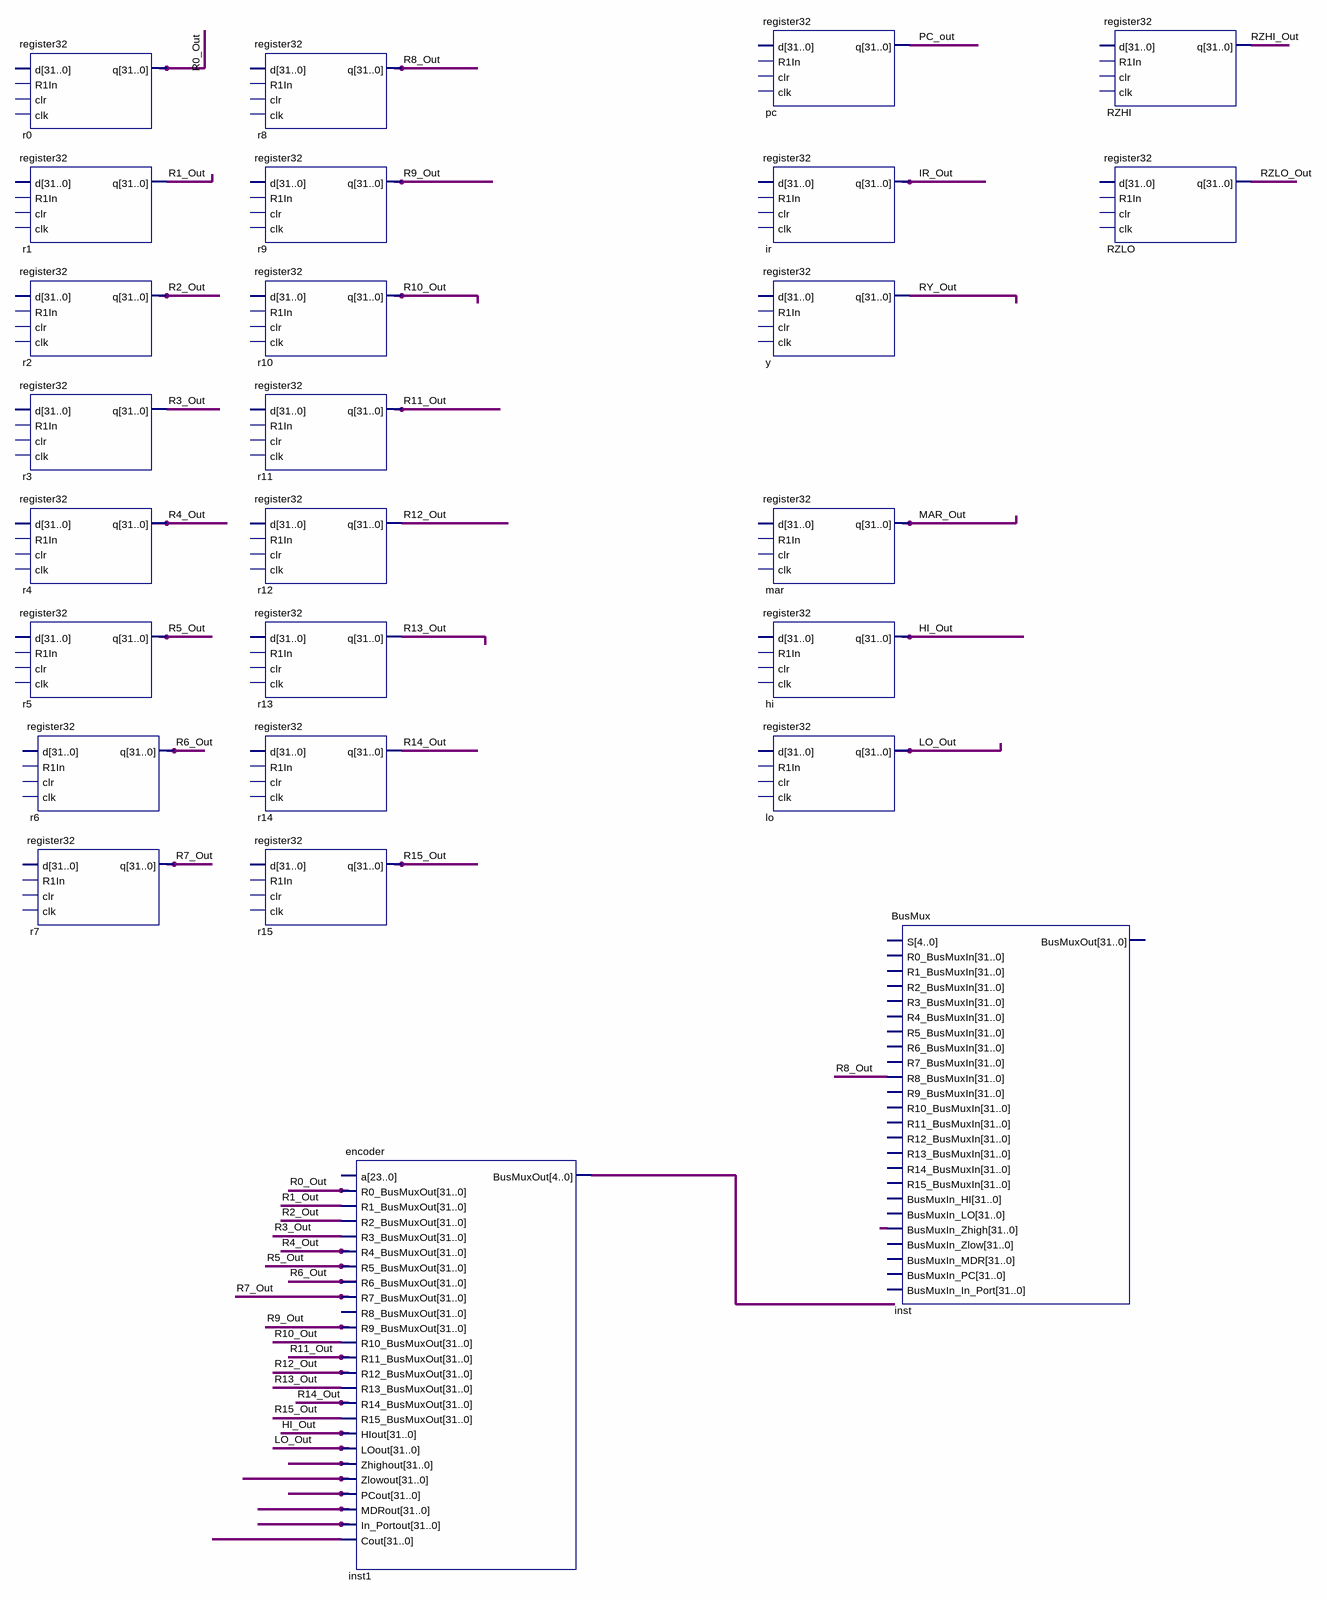
[diagram p0: schematic sheet]
// Quartus schematic Phase1Schematic.bdf as structural Verilog: 26 symbols, 0 pins
module Phase1Schematic (
);

  wire HI_Out, IR_Out, LO_Out, MAR_Out, PC_out, R0_Out, R1_Out, R2_Out, R3_Out, R4_Out, R5_Out, R6_Out,
       R7_Out, R8_Out, R9_Out, R10_Out, R11_Out, R12_Out, R13_Out, R14_Out, R15_Out, RY_Out, RZHI_Out,
       RZLO_Out;
  wire [4:0] inst1_busmuxout;
  wire [31:0] undriven, undriven_2, undriven_3, undriven_4, undriven_5, undriven_6, undriven_7;

  register32 r0 (.q(R0_Out));  // open: d, R1In, clr, clk
  register32 r1 (.q(R1_Out));  // open: d, R1In, clr, clk
  register32 r2 (.q(R2_Out));  // open: d, R1In, clr, clk
  register32 r3 (.q(R3_Out));  // open: d, R1In, clr, clk
  register32 r4 (.q(R4_Out));  // open: d, R1In, clr, clk
  register32 r5 (.q(R5_Out));  // open: d, R1In, clr, clk
  register32 r6 (.q(R6_Out));  // open: d, R1In, clr, clk
  register32 r7 (.q(R7_Out));  // open: d, R1In, clr, clk
  register32 r8 (.q(R8_Out));  // open: d, R1In, clr, clk
  register32 r9 (.q(R9_Out));  // open: d, R1In, clr, clk
  register32 r10 (.q(R10_Out));  // open: d, R1In, clr, clk
  register32 r11 (.q(R11_Out));  // open: d, R1In, clr, clk
  register32 r12 (.q(R12_Out));  // open: d, R1In, clr, clk
  register32 r13 (.q(R13_Out));  // open: d, R1In, clr, clk
  register32 r14 (.q(R14_Out));  // open: d, R1In, clr, clk
  register32 r15 (.q(R15_Out));  // open: d, R1In, clr, clk
  encoder inst1 (
    .R0_BusMuxOut({32{R0_Out}}), .R1_BusMuxOut({32{R1_Out}}), .R2_BusMuxOut({32{R2_Out}}),
    .R3_BusMuxOut({32{R3_Out}}), .R4_BusMuxOut({32{R4_Out}}), .R5_BusMuxOut({32{R5_Out}}),
    .R6_BusMuxOut({32{R6_Out}}), .R7_BusMuxOut({32{R7_Out}}), .R9_BusMuxOut({32{R9_Out}}),
    .R10_BusMuxOut({32{R10_Out}}), .R11_BusMuxOut({32{R11_Out}}), .R12_BusMuxOut({32{R12_Out}}),
    .R13_BusMuxOut({32{R13_Out}}), .R14_BusMuxOut({32{R14_Out}}), .R15_BusMuxOut({32{R15_Out}}),
    .HIout({32{HI_Out}}), .LOout({32{LO_Out}}), .Zhighout(undriven_3), .Zlowout(undriven_4),
    .PCout(undriven_5), .MDRout(undriven_6), .In_Portout(undriven_7), .Cout(undriven_2),
    .BusMuxOut(inst1_busmuxout));  // open: a, R8_BusMuxOut
  register32 pc (.q(PC_out));  // open: d, R1In, clr, clk
  register32 ir (.q(IR_Out));  // open: d, R1In, clr, clk
  register32 y (.q(RY_Out));  // open: d, R1In, clr, clk
  register32 mar (.q(MAR_Out));  // open: d, R1In, clr, clk
  register32 hi (.q(HI_Out));  // open: d, R1In, clr, clk
  register32 lo (.q(LO_Out));  // open: d, R1In, clr, clk
  BusMux inst (
    .R8_BusMuxIn({32{R8_Out}}), .BusMuxIn_Zhigh(undriven));  // open: S, R0_BusMuxIn, R1_BusMuxIn, R2_BusMuxIn, R3_BusMuxIn, R4_BusMuxIn, R5_BusMuxIn, R6_BusMuxIn, R7_BusMuxIn, R9_BusMuxIn, R10_BusMuxIn, R11_BusMuxIn, R12_BusMuxIn, R13_BusMuxIn, R14_BusMuxIn, R15_BusMuxIn, BusMuxIn_HI, BusMuxIn_LO, BusMuxIn_Zlow, BusMuxIn_MDR, BusMuxIn_PC, BusMuxIn_In_Port, BusMuxOut
  register32 RZHI (.q(RZHI_Out));  // open: d, R1In, clr, clk
  register32 RZLO (.q(RZLO_Out));  // open: d, R1In, clr, clk
endmodule
